# Altium schematic sheet Sheet1.SchDoc
size 209 x 297 mm; PageSetup: Record=PageOptions|CenterHorizontal=True|CenterVertical=True|PrintScale=0.94|XCorrection=1.00|YCorrection=1.00|PrintKind=1|BorderSize=5000000|LeftOffset=0|BottomOffset=0|Orientation=1|PaperLength=1000|PaperWidth=1000|Scale=100|PaperSource=7|PrintQuality=-4|MediaType=1|DitherType=10|PaperKind=A4|PrintScaleMode=1; DecimalNumber: Децимальный номер; HeadOfSector: Нач. сектора; MainDevice: Перв.примен.; Name1: Наименование1; t_kontr: Т. Контр; n_kontr: Н. Контр; lit_A: О; Name2: Наименование2; Name: Наименование; TitleBlock07: 1; TitleBlock25: TitleBlock25
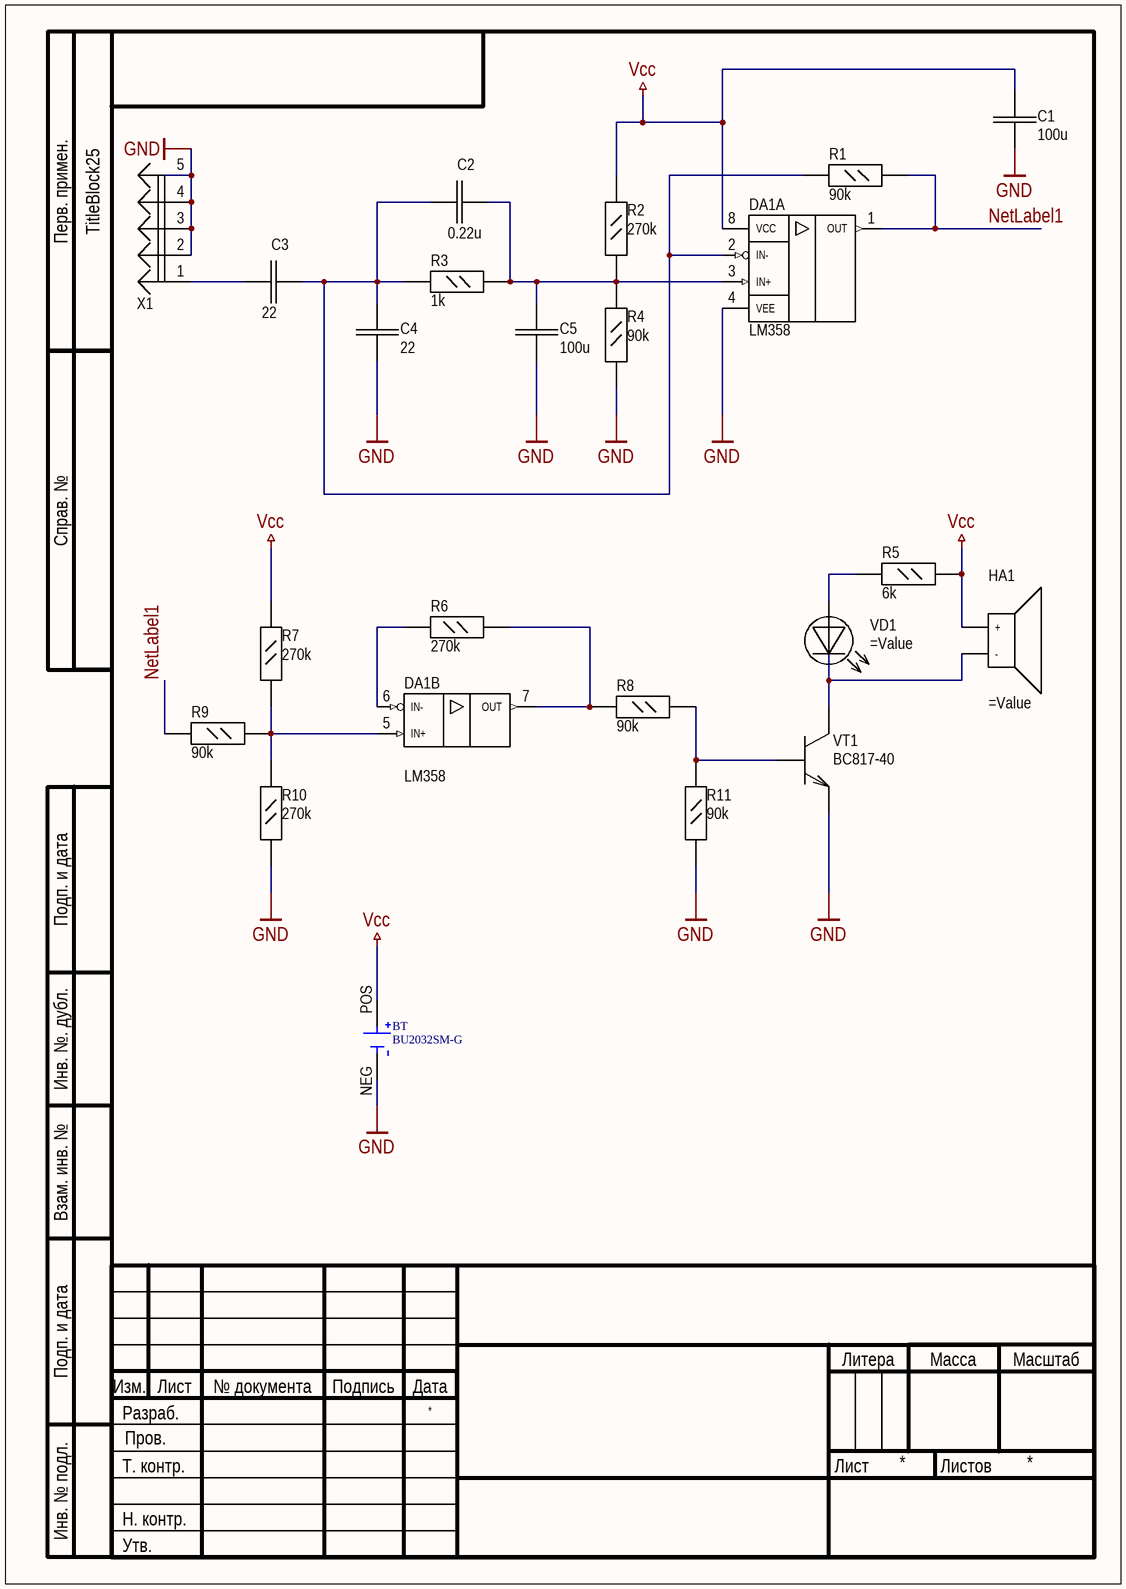
[diagram p0: Sheet1.SchDoc]

## Parts
BT  BU2032SM-G  [BAT_BU2032SM-G]
C1  100u  [RESC0603]
C2  0.22u  [RESC0603]
C3  22  [RESC0603]
C4  22  [RESC0603]
C5  100u  [RESC0603]
DA1  LM358  [SOIC-8]  (parts A,B of 2)
HA1  (no value)  [PKLCS1212E4001]
R1  90k  [RESC0603]
R2  270k  [RESC0603]
R3  1k  [RESC0603]
R4  90k  [RESC0603]
R5  6k  [RESC0603]
R6  270k  [RESC0603]
R7  270k  [RESC0603]
R8  90k  [RESC0603]
R9  90k  [RESC0603]
R10  270k  [RESC0603]
R11  90k  [RESC0603]
VD1  (no value)  [RESC0603]
VT1  BC817-40  [SOT-23]
X1  (no value)  [CONSMA008G]

## Nets
GND: BT.NEG C1.1 C4.1 C5.1 DA1.4(VEE) R4.1 R10.1 R11.1 VT1.1(E) X1.2 X1.3 X1.4 X1.5
Vcc: BT.POS C1.2 DA1.8(VCC) HA1.1(+) R2.2 R5.2 R7.2
NetLabel1: DA1.1(OUT) R1.2 R9.1
NetC2_1: C2.1 C3.2 C4.2 DA1.2(IN-) R1.1 R3.1
NetC2_2: C2.2 C5.2 DA1.3(IN+) R2.1 R3.2 R4.2
NetC3_1: C3.1 X1.1
NetDA1_5: DA1.5(IN+) R7.1 R9.2 R10.2
NetDA1_6: DA1.6(IN-) R6.2
NetDA1_7: DA1.7(OUT) R6.1 R8.1
NetHA1_2: HA1.2(-) VD1.1(K) VT1.3(C)
NetR5_1: R5.1 VD1.2(A)
NetR8_2: R8.2 R11.2 VT1.2(B)

## Notes on the sheet
- Перв. примен.
- Справ. №
- Подп. и дата
- Инв. №. дубл.
- Взам. инв. №
- Изм.
- Лист
- № документа
- Подпись
- Дата
- Литера
- Масса
- Масштаб
- Разраб.
- Т. контр.
- Пров.
- Листов
- Инв. № подл.
- Н. контр.
- Утв.

## Library data of the parts
BT = BU2032SM-G: BATTERY HOLDER COIN 20MM SMD; MF: MPD; MP: BU2032SM-G; Package: None; Availability: Unavailable; Price: None; SnapEDA_Link: https://www.snapeda.com/parts/BU2032SM-G/Memory%20Protection%20Devices/view-part/4219599/?ref=snap; Value: *
C1-C5 = Cap-SMD-0603: Конденсатор СМД; TypeMaterial: керам; GOSTGroup: Конденсаторы; TypeCase: СМД; Case: 0603; Dielectric: *; VoltageRating: *; PowerRating: *
  C1 C5: Value: 100u
  C2: Value: 0.22u
  C3 C4: Value: 22
DA1 = LM1458: Микросхема, операционный усилитель; value: LM358
HA1 = SMA-24L-P10: Пьезоизлучатель
R1-R11 = Res-0603-0.25W: Резистор СМД; PowerRating: 0.25Вт; PPM: 5%; GOSTGroup: Резисторы; VoltageRating: *
  R1 R4 R8 R9 R11: Value: 90k
  R2 R6 R7 R10: Value: 270k
  R3: Value: 1k
  R5: Value: 6k
VD1 = Led: Светодиод
VT1 = Transistor NPN: Транзистор биполярный  NPN; value: BC817-40
X1 = Header 5M: Разъем 5, папа